# Altium schematic sheet Schematic.SchDoc
size A; SheetNumber: 1; SheetTotal: 1
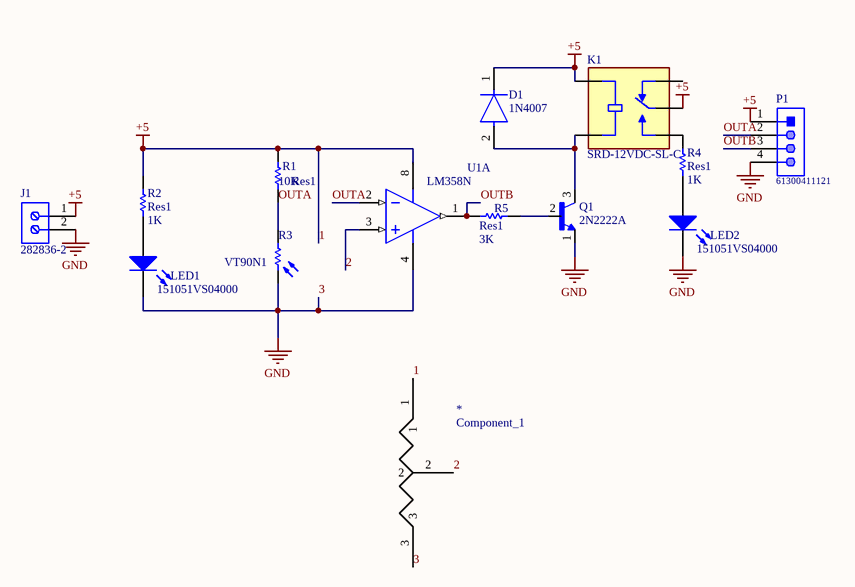
[diagram p0: Schematic.SchDoc]

## Parts
*  Component_1  [PCBComponent_1]
D1  1N4007  [FP-1N4007-MFG]
J1  282836-2  [TECO-282836-2_V]
K1  SRD-12VDC-SL-C  [RELAY_SRD-12VDC-SL-C]
LED1  151051VS04000  [Type 5mm]
LED2  151051VS04000  [Type 5mm]
P1  61300411121  [61300411121]
Q1  2N2222A  [TO127P584H533-3]
R1  Res1  value 10K  [AXIAL-0.3]
R2  Res1  value 1K  [AXIAL-0.3]
R3  VT90N1  [EXCE-VT90N1]
R4  Res1  value 1K  [AXIAL-0.3]
R5  Res1  value 3K  [AXIAL-0.3]
U1  LM358N  [ONSC-PDIP-8-626-05_M]  (part A of 2)

## Nets
1: *.1 D1.1(C) J1.1 K1.COIL1 K1.COM P1.1 R1.2 R2.2 U1.8(VCC)  [also labelled +5]
3: *.3 J1.2 LED1.1(K) LED2.1(K) P1.4 Q1.1(E) R3.2 U1.4(VEE/GND)  [also labelled GND]
2: *.2 U1.3(INA+)
OUTA: P1.2 R1.1 R3.1 U1.2(INA-)
OUTB: P1.3 R5.1 U1.1(OUTA)
NetD1_2: D1.2(A) K1.COIL2 Q1.3(C)
NetK1_NO: K1.NO R4.2
NetLED1_2: LED1.2(A) R2.1
NetLED2_2: LED2.2(A) R4.1
NetQ1_2: Q1.2(B) R5.2

Not connected (* = marked no-connect by the designer): K1 NC

## Library data of the parts
D1 = CMP-123542-000001-1: Rectifier diode 1000 V 1 A DO-41, ,; Manufacturer: Diotec; Max Surge Forward Current: 27A; Forward Current: 1A; Max Junction Temp: +175°C; Reverse Voltage: 1000V; Value: 15pF; Peak Reverse Current: 5uA; Category: Diode; Temperature Range Low: -50°C; Automotive: No; Temperature: -50°C to +175°C; Lead Free: Yes; ComponentLink2Description: Datasheet; Max Repetitive Reverse Voltage: 1000V; ComponentLink2URL: https://datasheet.octopart.com/1N4007-Diotec-datasheet-62346875.pdf; Manufacturer Part Number: 1N4007; Device Class L3: Rectifier Diodes; Height: 2.8mm; Octopart: https://octopart.com/1n4007-diotec-4040411; Package: 1N4007; Temperature Range High: +175°C; Device Class L1: Discrete Semiconductors; Device Class L2: Diodes; RoHS: TRUE; Capacitance: 15pF; Ipc Land Pattern Name: DIOAD888W100L520D280
J1 = CMP-1684-00017-1: Female Header, Pitch 5 mm, 1 x 2 Position, Height 10 mm, Tail Length 3.5 mm, Rohs, Bulk; Manufacturer: TE Connectivity; Wire Gauge: 16-30AWG; Product Training Modules: Wire-to-BoardEurostyleTerminalBlocks; Clamp Material - Plating: Brass-NickelPlated; Voltage: 300V; Mating Orientation: HorizontalwithBoard; Current: 13.5A; Pitch: 0.197"(5.00mm); Screw Thread: M3; 3D Model: 282836-2.pdf; Other Names: 5ULV-02B / A98076; Dynamic Catalog: BuchananSeries; Number of Levels: 1; Torque - Screw: 0.68Nm(6Lb-In); Featured Product: EurostyleTerminalBlockConnectors; Positions Per Level: 2; Wire Termination: Screw-RisingCageClamp; Datasheet URL: http://www.te.com.cn/commerce/DocumentDelivery/DDEController?Action=showdoc&DocId=Catalog+Section%7F1308389_EUROSTYLE_TERMINAL_BLOCKS%7F0607%7Fpdf%7FEnglish%7FENG_CS_1308389_EUROSTYLE_TERMINAL_BLOCKS_0607.pdf%7F282836-2; Color: Green; Family: TerminalBlocks-WiretoBoard; RoHS Information: 282836-2StatementofCompliance; Standard Package: 300; Contact Material - Plating: Brass-TinPlated; Manufacturer URL: http://www.te.com; Housing Material: Polyamide(PA66),Nylon6/6; Features: Interlocking(Side); Package Description: Female Header, Pitch 5 mm, 1 x 2 Position, Height 10 mm, Tail Length 3.5 mm; Mounting Type: ThroughHole; Package Reference: THD; Packaging: Bulk; Series: Buchanan; Category: Connectors,Interconnects; Screw Material - Plating: Brass-NickelPlated
K1 = SRD-12VDC-SL-C: General Purpose Non Latching 12VDC SPDT Through Hole Relays RoHS; MF: {'manufacturer': u'Songle Relay'}; Availability: Unavailable; Value: *; Price: None; MP: SRD-12VDC-SL-C; Package: None
LED1 LED2 = CMP-1488-00007-1: THT LED round mono-color color lens, WL-TMRW, Bright Green; Manufacturer: Wuerth Elektronik; Emitting color: Bright Green; ComponentLink1Description: Manufacturer URL; PackageReference: Type 5mm; PartNumber: 151051VS04000; ComponentLink2URL: http://katalog.we-online.de/pbs/datasheet/7448042001.pdfhttp://katalog.we-online.de/pbs/datasheet/7448042001.pdfhttp://katalog.we-online.de/pbs/datasheet/7448042001.pdfhttp://katalog.we-online.de/pbs/datasheet/151051VS04000.pdf; ComponentLink1URL: http://www.we-online.com; ComponentLink2Description: Datasheet
P1 = CMP-1502-01064-1: THT Vertical Pin Header WR-PHD, Pitch 2.54 mm, Single Row, 4 pins; Manufacturer: Wurth Elektronik; Withstanding Voltage: 500VAC; Rated Current: 3A; Working Voltage: 250VAC; Pin Number: 4; Gender: Male; Contact Resistance: 20mOhm; Pitch: 2.54mm; Manufacturer URL: http://www.we-online.de; Operating Temperature: -40to105degC; Packaging: Bag; Mounting Technology: THT; Package Reference: 61300411121; Datasheet URL: https://katalog.we-online.de/em/datasheet/6130xx11121.pdf; Publisher: WurthElektronik; Part Number: 61300411121; Row Number: Single; Orientation: Vertical
Q1 = 2N2222A: 2N2222A 50 V 800 mA NPN Silicon Switching Transistor - TO-18 (TO-206AA); MF: {'manufacturer': u'Diotec Semiconductor'}; Availability: Unavailable; Value: *; Price: None; MP: 2N2222A; Package: None
R1 R2 R4 R5 = Res1: Resistor; Published: 8-Jun-2000; LatestRevisionDate: 17-Jul-2002; LatestRevisionNote: Re-released for DXP Platform.; PackageReference: AXIAL-0.3; Publisher: Altium Limited; PackageDescription: Axial Device, Thru-Hole; 2 Leads; 0.3 in Pin Spacing
R3 = CMP-2000-07406-1: Photoconductive Resistor, 200 kOhm, 100 V, 80 mW, -40 to 75 degC, 2-Pin THD, RoHS; Manufacturer: Excelitas Technology; SVHC: Cadmiumchloride(15-Jun-2015); Power Rating: 80mW; Resistance @ Lux: 12kohm; Voltage Rating: 100V; Product Range: -; Datasheet Version: 09/2006; Resistor Case Style: -; Operating Temperature Max: 75°C; Package Reference: VT90N1; Datasheet URL: http://datasheet.octopart.com/VT90N1-Excelitas-datasheet-10388451.pdf; Mounting Technology: ThroughHole; Operating Temperature Min: -40°C; Dark Resistance: 200kohm; Package Description: 2-Pin Through Hole Device, Body Width 4.17 mm (Max), Height 2.29 mm; Manufacturer URL: http://www.excelitas.com/Pages/Index.aspx; Packaging: Each
U1 = CMP-1310-00098-1: Single Supply Dual Operational Amplifier, 3 to 32 V, 0 to 70 degC, 8-Pin PDIP, Tube; Manufacturer: On Semiconductor; VCC Max (V): 32; VCC Min (V): 3; Mounting Technology: Through Hole; ComponentLink3Description: Package Specification; ComponentLink3URL: http://www.onsemi.com/pub_link/Collateral/LM211-D.PDF; RoHS: FALSE; Packing: Tube; PackageDescription: 8-Pin Plastic Dual-In Line Package, Body 9.52 x 6.605 mm, Pitch 2.54 mm; PackageReference: PDIP-8-626-05; PackageVersion: Rev. M, 04/2010; PartNumber: LM358N; ComponentLink2Description: Datasheet; ComponentLink2URL: http://www.onsemi.cn/pub_link/Collateral/LM358-D.PDF; ComponentLink1URL: http://www.onsemi.com/; ComponentLink1Description: Manufacturer URL; DatasheetVersion: Rev. 27